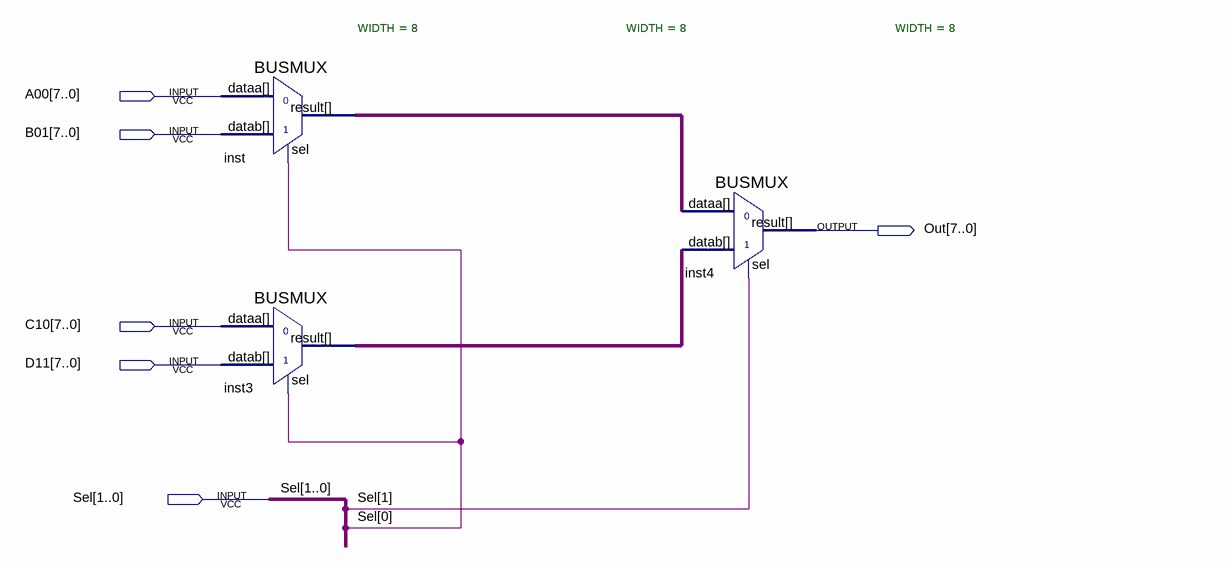
[diagram p0: schematic sheet]
// Quartus schematic Mux_4to1_8bit.bdf as structural Verilog: 3 symbols, 6 pins
module Mux_4to1_8bit (
  input  [7:0] A00,
  input  [7:0] B01,
  input  [7:0] C10,
  input  [7:0] D11,
  input  [1:0] Sel,
  output [7:0] Out
);

  wire [7:0] inst3_result, inst_result;

  BUSMUX #(.WIDTH(8)) inst (.datab(B01), .sel(Sel[0]), .dataa(A00), .result(inst_result));
  BUSMUX #(.WIDTH(8)) inst3 (.datab(D11), .sel(Sel[0]), .dataa(C10), .result(inst3_result));
  BUSMUX #(.WIDTH(8)) inst4 (.datab(inst3_result), .sel(Sel[1]), .dataa(inst_result), .result(Out));
endmodule
